# Altium schematic sheet PC_Memory.SchDoc: Payload Computer - Memory Interface and ICs
size A3; Engineer: Matt Brindley; Organization: BLUEsat Project; Address1: Room 419; Address2: School of EE&T; Address3: UNSW, NSW 2052; Address4: Australia
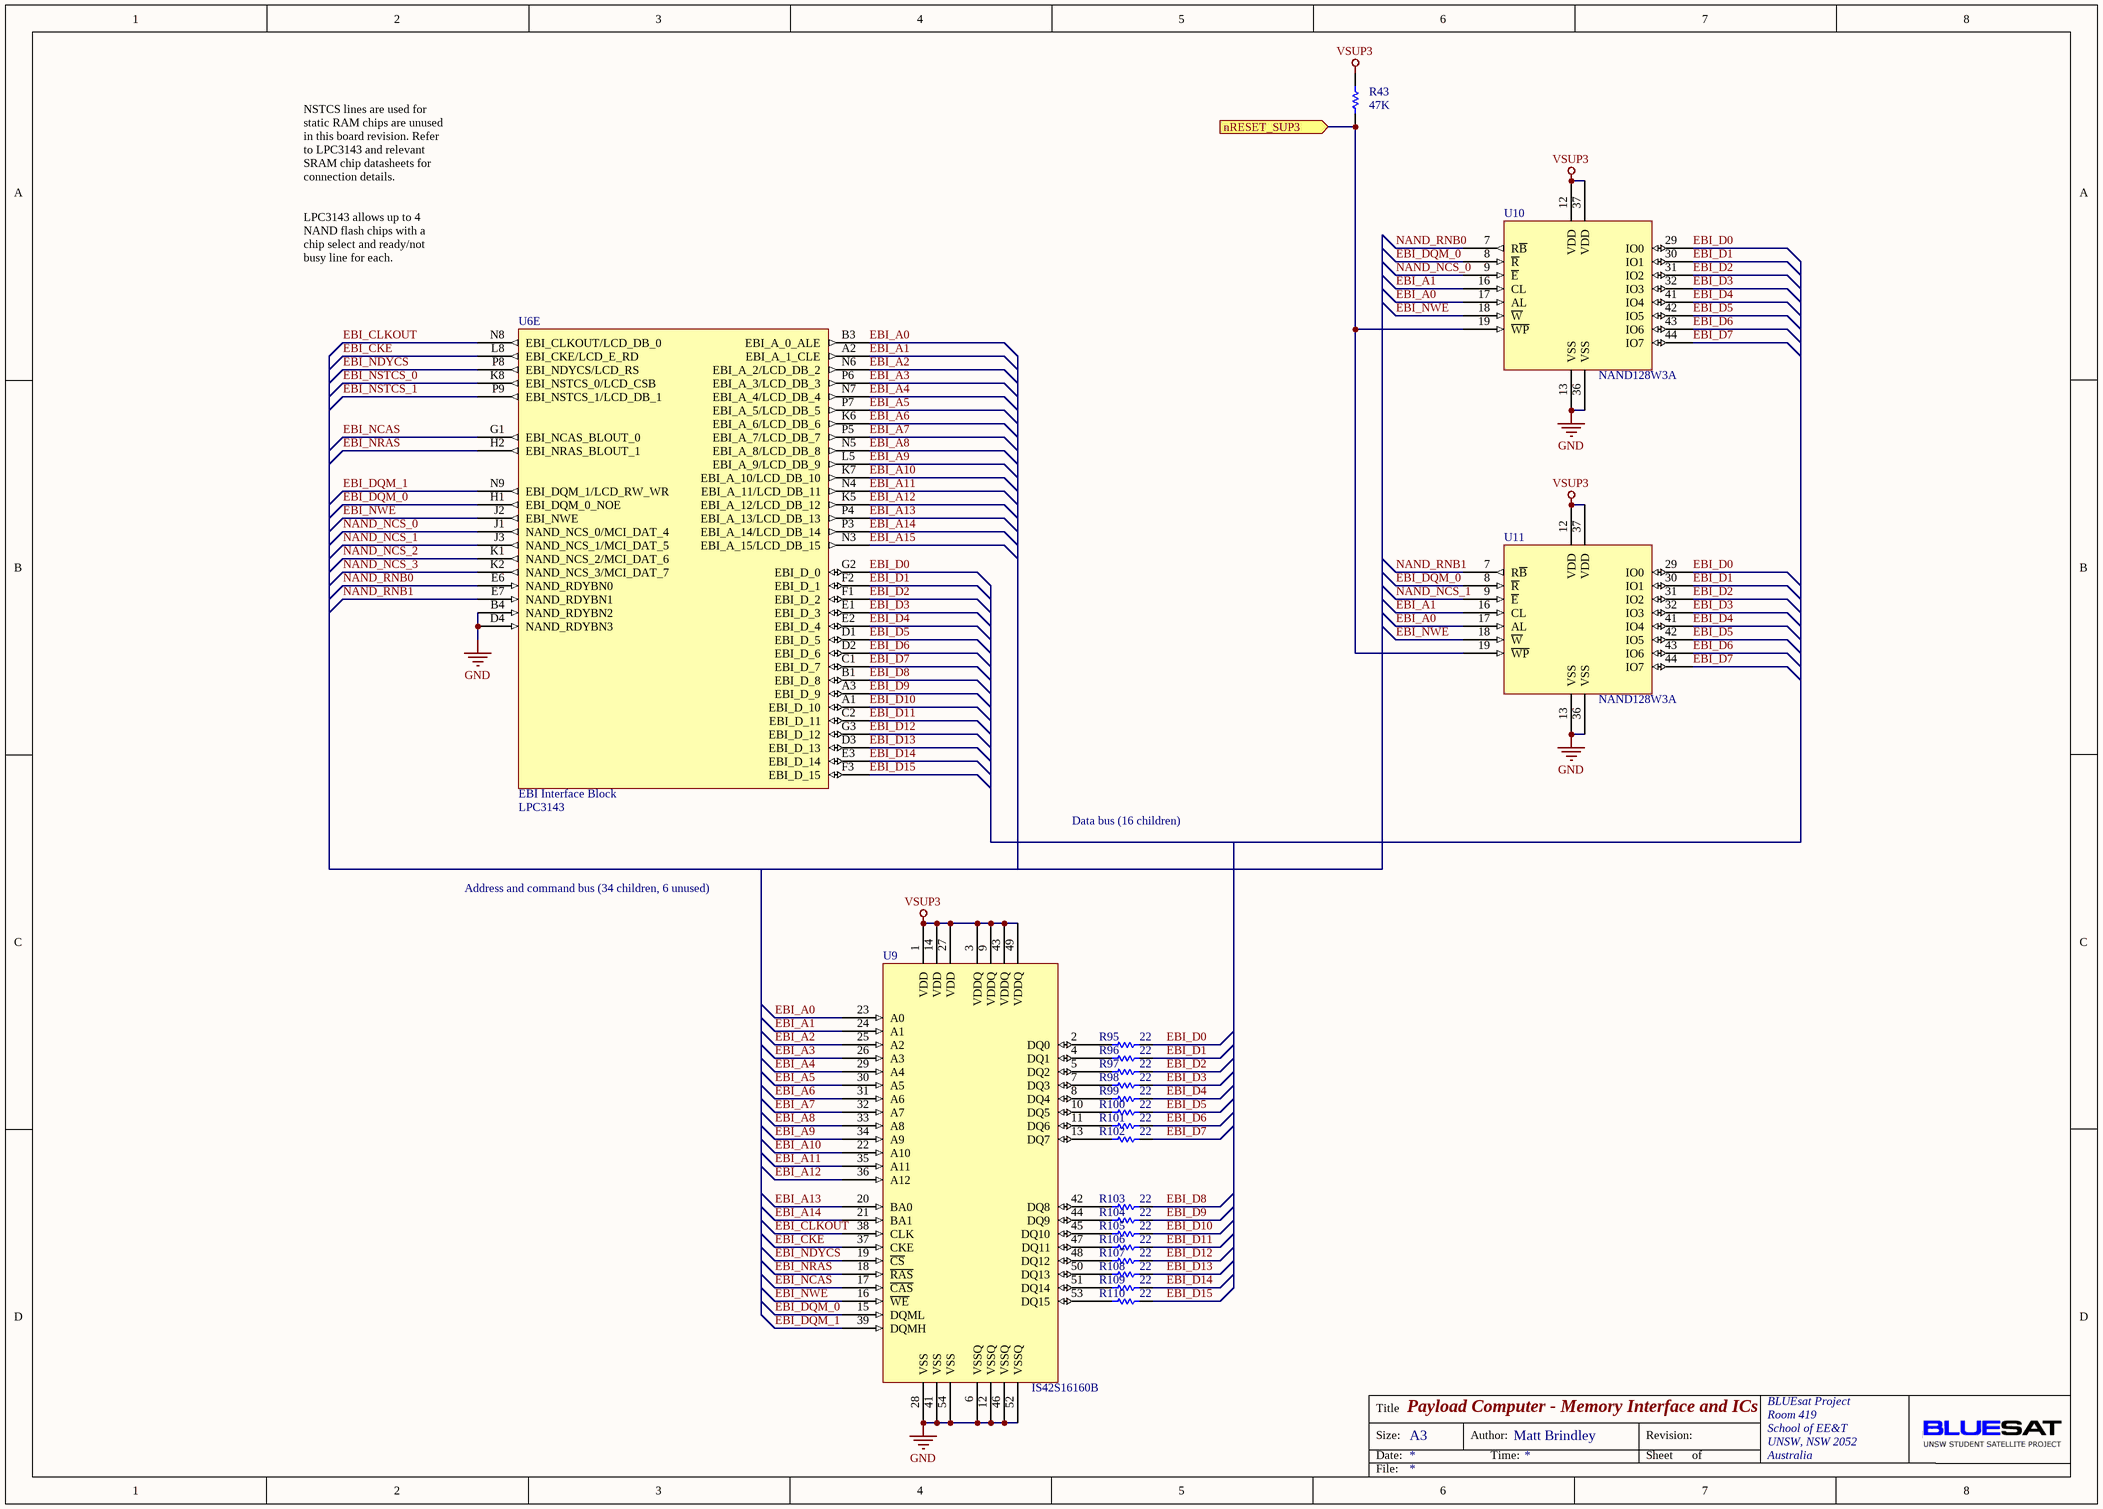
[diagram p0: PC_Memory.SchDoc]

## Parts
R43  value 47K  [6-0805_L]  (hidden comment: Res Semi)
R95  value 22  [6-0805_L]  (hidden comment: Res Semi)
R96  value 22  [6-0805_L]  (hidden comment: Res Semi)
R97  value 22  [6-0805_L]  (hidden comment: Res Semi)
R98  value 22  [6-0805_L]  (hidden comment: Res Semi)
R99  value 22  [6-0805_L]  (hidden comment: Res Semi)
R100  value 22  [6-0805_L]  (hidden comment: Res Semi)
R101  value 22  [6-0805_L]  (hidden comment: Res Semi)
R102  value 22  [6-0805_L]  (hidden comment: Res Semi)
R103  value 22  [6-0805_L]  (hidden comment: Res Semi)
R104  value 22  [6-0805_L]  (hidden comment: Res Semi)
R105  value 22  [6-0805_L]  (hidden comment: Res Semi)
R106  value 22  [6-0805_L]  (hidden comment: Res Semi)
R107  value 22  [6-0805_L]  (hidden comment: Res Semi)
R108  value 22  [6-0805_L]  (hidden comment: Res Semi)
R109  value 22  [6-0805_L]  (hidden comment: Res Semi)
R110  value 22  [6-0805_L]  (hidden comment: Res Semi)
U6  LPC3143  [BGA180C80P14X14_1200X1200X120]  (part E of 11)
U9  IS42S16160B  [TSOP80P1180X120-54M]
U10  NAND128W3A  [TSSOP50P2000X120-48M]
U11  NAND128W3A  [TSSOP50P2000X120-48M]

## Ports
nRESET_SUP3 (in)

## Nets
GND: U6.B4(NAND_RDYBN2) U6.D4(NAND_RDYBN3) U9.6(VSSQ) U9.12(VSSQ) U9.28(VSS) U9.41(VSS) U9.46(VSSQ) U9.52(VSSQ) U9.54(VSS) U10.13(VSS) U10.36(VSS) U11.13(VSS) U11.36(VSS)
VSUP3: R43.2 U9.1(VDD) U9.3(VDDQ) U9.9(VDDQ) U9.14(VDD) U9.27(VDD) U9.43(VDDQ) U9.49(VDDQ) U10.12(VDD) U10.37(VDD) U11.12(VDD) U11.37(VDD)
EBI_A0: U6.B3(EBI_A_0_ALE) U9.23(A0) U10.17(AL) U11.17(AL)
EBI_A1: U6.A2(EBI_A_1_CLE) U9.24(A1) U10.16(CL) U11.16(CL)
EBI_A2: U6.N6(EBI_A_2/LCD_DB_2) U9.25(A2)
EBI_A3: U6.P6(EBI_A_3/LCD_DB_3) U9.26(A3)
EBI_A4: U6.N7(EBI_A_4/LCD_DB_4) U9.29(A4)
EBI_A5: U6.P7(EBI_A_5/LCD_DB_5) U9.30(A5)
EBI_A6: U6.K6(EBI_A_6/LCD_DB_6) U9.31(A6)
EBI_A7: U6.P5(EBI_A_7/LCD_DB_7) U9.32(A7)
EBI_A8: U6.N5(EBI_A_8/LCD_DB_8) U9.33(A8)
EBI_A9: U6.L5(EBI_A_9/LCD_DB_9) U9.34(A9)
EBI_A10: U6.K7(EBI_A_10/LCD_DB_10) U9.22(A10)
EBI_A11: U6.N4(EBI_A_11/LCD_DB_11) U9.35(A11)
EBI_A12: U6.K5(EBI_A_12/LCD_DB_12) U9.36(A12)
EBI_A13: U6.P4(EBI_A_13/LCD_DB_13) U9.20(BA0)
EBI_A14: U6.P3(EBI_A_14/LCD_DB_14) U9.21(BA1)
EBI_A15: U6.N3(EBI_A_15/LCD_DB_15)
EBI_CKE: U6.L8(EBI_CKE/LCD_E_RD) U9.37(CKE)
EBI_CLKOUT: U6.N8(EBI_CLKOUT/LCD_DB_0) U9.38(CLK)
EBI_D0: R95.2 U6.G2(EBI_D_0) U10.29(IO0) U11.29(IO0)
EBI_D1: R96.2 U6.F2(EBI_D_1) U10.30(IO1) U11.30(IO1)
EBI_D2: R97.2 U6.F1(EBI_D_2) U10.31(IO2) U11.31(IO2)
EBI_D3: R98.2 U6.E1(EBI_D_3) U10.32(IO3) U11.32(IO3)
EBI_D4: R99.2 U6.E2(EBI_D_4) U10.41(IO4) U11.41(IO4)
EBI_D5: R100.2 U6.D1(EBI_D_5) U10.42(IO5) U11.42(IO5)
EBI_D6: R101.2 U6.D2(EBI_D_6) U10.43(IO6) U11.43(IO6)
EBI_D7: R102.2 U6.C1(EBI_D_7) U10.44(IO7) U11.44(IO7)
EBI_D8: R103.2 U6.B1(EBI_D_8)
EBI_D9: R104.2 U6.A3(EBI_D_9)
EBI_D10: R105.2 U6.A1(EBI_D_10)
EBI_D11: R106.2 U6.C2(EBI_D_11)
EBI_D12: R107.2 U6.G3(EBI_D_12)
EBI_D13: R108.2 U6.D3(EBI_D_13)
EBI_D14: R109.2 U6.E3(EBI_D_14)
EBI_D15: R110.2 U6.F3(EBI_D_15)
EBI_DQM_0: U6.H1(EBI_DQM_0_NOE) U9.15(DQML) U10.8(~{R}) U11.8(~{R})
EBI_DQM_1: U6.N9(EBI_DQM_1/LCD_RW_WR) U9.39(DQMH)
EBI_NCAS: U6.G1(EBI_NCAS_BLOUT_0) U9.17(~{CAS})
EBI_NDYCS: U6.P8(EBI_NDYCS/LCD_RS) U9.19(~{CS})
EBI_NRAS: U6.H2(EBI_NRAS_BLOUT_1) U9.18(~{RAS})
EBI_NSTCS_0: U6.K8(EBI_NSTCS_0/LCD_CSB)
EBI_NSTCS_1: U6.P9(EBI_NSTCS_1/LCD_DB_1)
EBI_NWE: U6.J2(EBI_NWE) U9.16(~{WE}) U10.18(~{W}) U11.18(~{W})
NAND_NCS_0: U6.J1(NAND_NCS_0/MCI_DAT_4) U10.9(~{E})
NAND_NCS_1: U6.J3(NAND_NCS_1/MCI_DAT_5) U11.9(~{E})
NAND_NCS_2: U6.K1(NAND_NCS_2/MCI_DAT_6)
NAND_NCS_3: U6.K2(NAND_NCS_3/MCI_DAT_7)
NAND_RNB0: U6.E6(NAND_RDYBN0) U10.7(R~{B})
NAND_RNB1: U6.E7(NAND_RDYBN1) U11.7(R~{B})
nRESET_SUP3: R43.1 U10.19(~{WP}) U11.19(~{WP}) ; port nRESET_SUP3
NetR95_1: R95.1 U9.2(DQ0)
NetR96_1: R96.1 U9.4(DQ1)
NetR97_1: R97.1 U9.5(DQ2)
NetR98_1: R98.1 U9.7(DQ3)
NetR99_1: R99.1 U9.8(DQ4)
NetR100_1: R100.1 U9.10(DQ5)
NetR101_1: R101.1 U9.11(DQ6)
NetR102_1: R102.1 U9.13(DQ7)
NetR103_1: R103.1 U9.42(DQ8)
NetR104_1: R104.1 U9.44(DQ9)
NetR105_1: R105.1 U9.45(DQ10)
NetR106_1: R106.1 U9.47(DQ11)
NetR107_1: R107.1 U9.48(DQ12)
NetR108_1: R108.1 U9.50(DQ13)
NetR109_1: R109.1 U9.51(DQ14)
NetR110_1: R110.1 U9.53(DQ15)

## Notes on the sheet
- NSTCS lines are used for static RAM chips are unused in this board revision. Refer to LPC3143 and relevant SRAM chip datasheets for connection details.
- LPC3143 allows up to 4 NAND flash chips with a chip select and ready/not busy line for each.
- Data bus (16 children)
- Address and command bus (34 children, 6 unused)
- Title
- Size:
- Date:
- A3
- Author:
- Time:
- Revision:
- Sheet
- of
- File:
- (in symbol LPC3143, part E) EBI Interface Block

## Library data of the parts
R43 R95-R110 = Res Semi: Semiconductor Resistor; Published: 8-Jun-2000; LatestRevisionDate: 17-Jul-2002; LatestRevisionNote: Re-released for DXP Platform.; PackageReference: AXIAL-0.5; Publisher: Altium Limited
U6 = LPC3143: NXP ARM9 based microcontroller; Published: N/A; LatestRevisionDate: 09/03/2010; LatestRevisionNote: Created; PackageReference: BGA; Publisher: BLUEsat Project
U9 = IS42S16160B: 16Mb x 16 (256Mb) Parallel Interface SDRAM; Published: 8-Jun-2000; LatestRevisionDate: 08-Jul-2005; LatestRevisionNote: Mech Layer 1 removed.; PackageReference: LED-0; Publisher: Altium Limited
U10 U11 = NAND128W3A: 128Mb 8b wide NAND Flash; Published: 8-Jun-2000; LatestRevisionDate: 08-Jul-2005; LatestRevisionNote: Mech Layer 1 removed.; PackageReference: LED-0; Publisher: Altium Limited